# EAGLE design HWProgUSB (EAGLE 6.4)
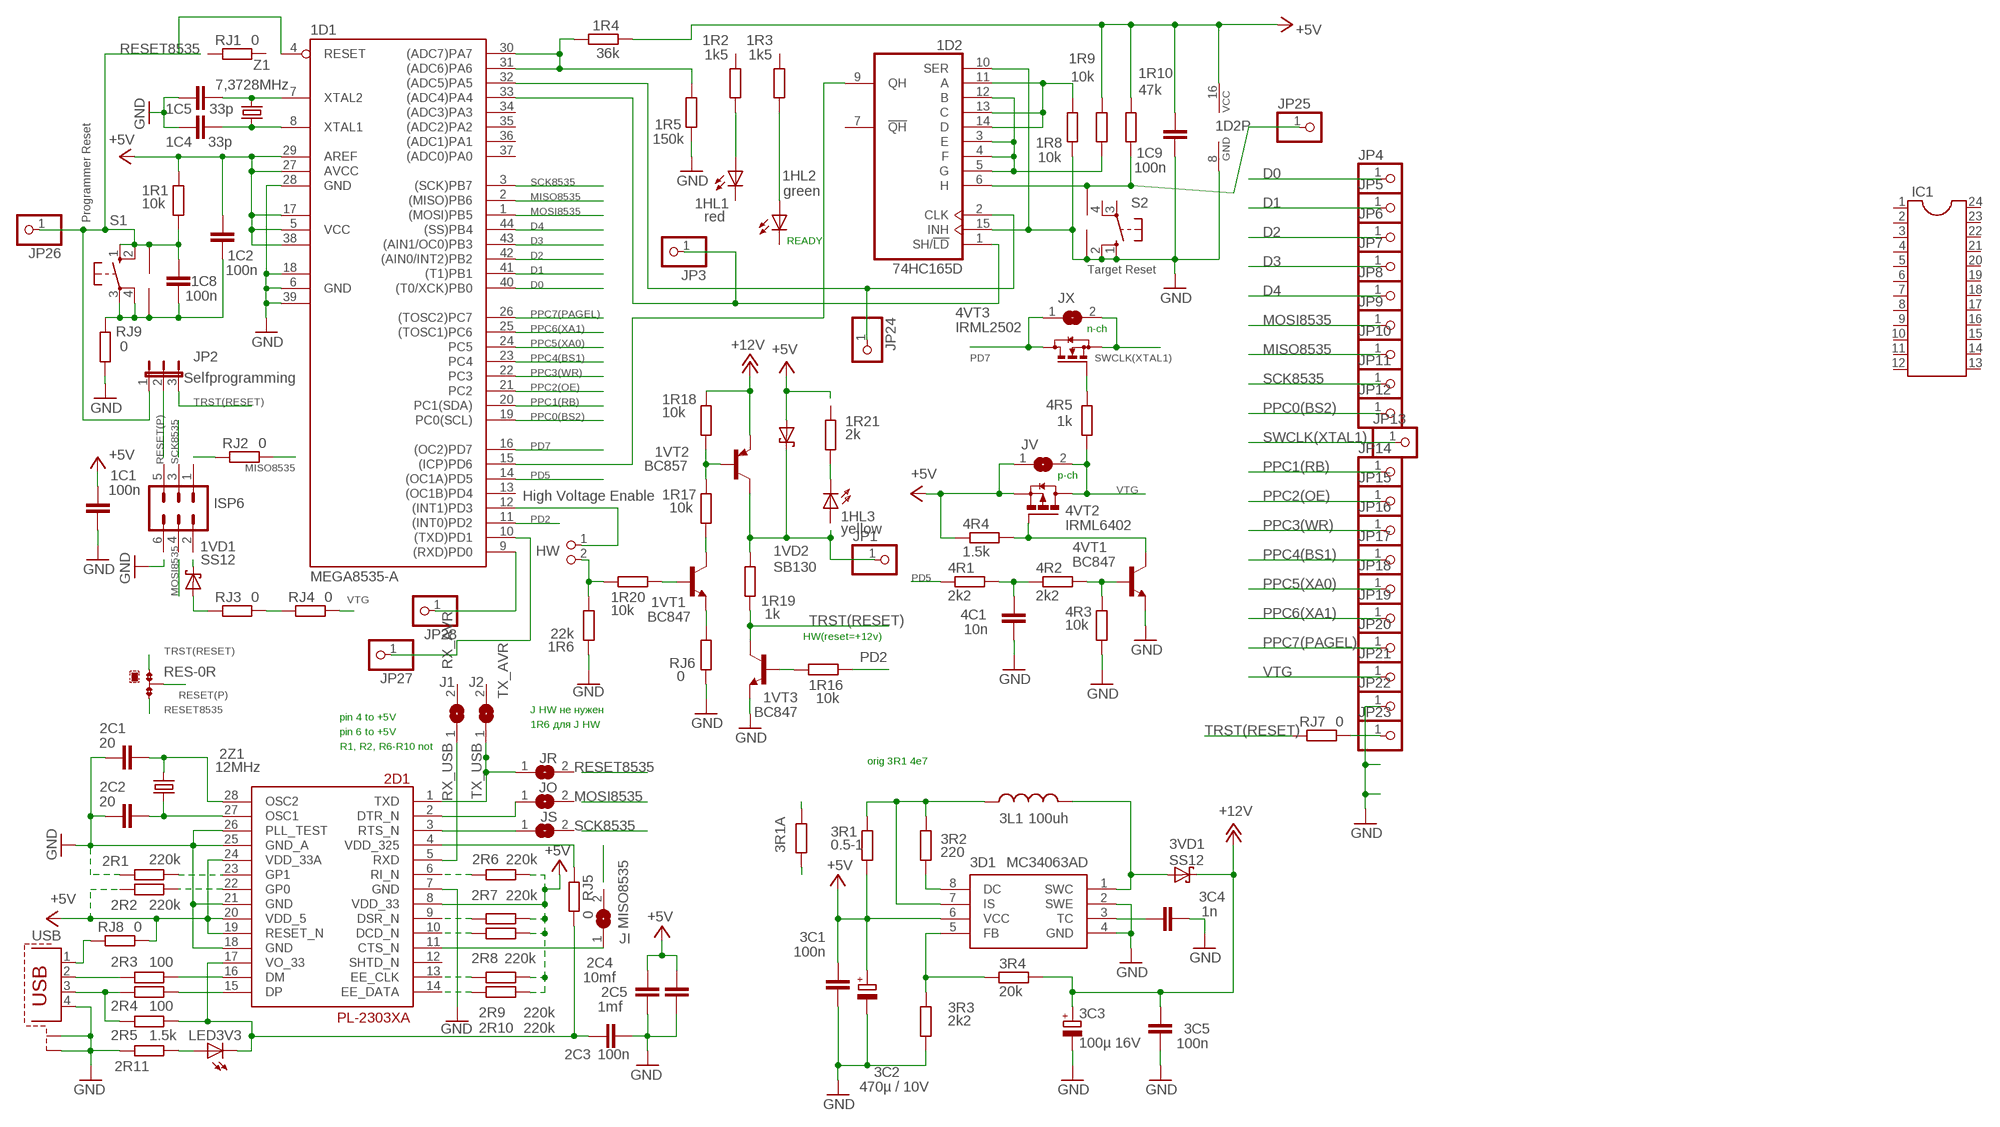
[diagram p0: schematic, sheet 1]

## Parts
1C1  100n  C-EUC0805  [C0805]
1C2  100n  C-EUC0805  [C0805]
1C4  33p  C-EUC0805  [C0805]
1C5  33p  C-EUC0805  [C0805]
1C8  100n  C-EUC0805  [C0805]
1C9  100n  C-EUC0805  [C0805]
1D1  MEGA8535-A  [TQFP44]
1D2  74HC165D  [SO16]
1HL1  red  LED5MM  [LED5MM]
1HL2  green  LED5MM  [LED5MM]
1HL3  yellow  LED5MM  [LED5MM]
1R1  10k  R-EU_M0805  [M0805]
1R2  1k5  R-EU_M0805  [M0805]
1R3  1k5  R-EU_M0805  [M0805]
1R4  36k  R-EU_M0805  [M0805]
1R5  150k  R-EU_R1206  [R1206]
1R6  22k  R-EU_M1206  [M1206]
1R8  10k  R-EU_M0805  [M0805]
1R9  10k  R-EU_M0805  [M0805]
1R10  47k  R-EU_M0805  [M0805]
1R16  10k  R-EU_R0805  [R0805]
1R17  10k  R-EU_M0805  [M0805]
1R18  10k  R-EU_M0805  [M0805]
1R19  1k  R-EU_M0805  [M0805]
1R20  10k  R-EU_M0805  [M0805]
1R21  2k  R-EU_R1206W  [R1206W]
1VD1  SS12  SCHOTTKY-DIODESMD  [SMB]
1VD2  SB130  SCHOTTKY-DIODESMD  [SMB]
1VT1  BC847  [SOT23]
1VT2  BC857  BC857A-PNP-SOT23-BEC  [SOT23-BEC]
1VT3  BC847  [SOT23]
2C1  20  C-EUC0805  [C0805]
2C2  20  C-EUC0805  [C0805]
2C3  100n  C-EUC0805  [C0805]
2C4  10mf  C-EUC1210  [C1210]
2C5  1mf  C-EUC0805  [C0805]
2D1  PL-2303XA  [SSOP28DB]
2R1  220k  R-EU_R0603  [R0603]
2R2  220k  R-EU_R1206W  [R1206W]
2R3  100  R-EU_R0603  [R0603]
2R4  100  R-EU_R0603  [R0603]
2R5  1.5k  R-EU_R0603  [R0603]
2R6  220k  R-EU_R1206W  [R1206W]
2R7  220k  R-EU_R0603  [R0603]
2R8  220k  R-EU_R0603  [R0603]
2R9  220k  R-EU_R0603  [R0603]
2R10  220k  R-EU_R0603  [R0603]
2R11  R-EU_R0603  [R0603]
2Z1  12MHz  CRYSTALHC49S  [HC49/S]
3C1  100n  C-EU025-024X044  [C025-024X044]
3C2  470µ / 10V  RCL_CPOL-EUE3.5-8  [RCL_E3,5-8]
3C3  100µ 16V  RCL_CPOL-EUE3.5-8  [RCL_E3,5-8]
3C4  1n  C-EU025-025X050  [C025-025X050]
3C5  100n  C-EU025-025X050  [C025-025X050]
3D1  MC34063AD  [SOIC8]
3L1  100uh  L-US0207/10  [0207/10]
3R1  0.5-1  R-EU_0204/7  [0204/7]
3R1A  R-EU_0204/7  [0204/7]
3R2  220  R-EU_0204/7  [0204/7]
3R3  2k2  R-EU_M0805  [M0805]
3R4  20k  R-EU_M0805  [M0805]
3VD1  SS12  SCHOTTKY-DIODESMD  [SMB]
4C1  10n  C-EUC1206  [C1206]
4R1  2k2  R-EU_M0805  [M0805]
4R2  2k2  R-EU_M1206  [M1206]
4R3  10k  R-EU_M0805  [M0805]
4R4  1.5k  R-EU_M0805  [M0805]
4R5  1k  R-EU_M0805  [M0805]
4VT1  BC847  [SOT23]
4VT2  IRML6402  FDN360P  [SUPER-SOT3]
4VT3  IRML2502  BSS123  [SOT23]
HW  High Voltage Enable  PINHEAD_PINHD-1X2  [PINHEAD_1X02]
IC1  DIL24-9  [DIL24-9]
ISP6  MA03-2  [MA03-2]
J1  SJ  [SJ]
J2  SJ  [SJ]
JI  SJ  [SJ]
JO  SJ  [SJ]
JP1  PINHD-1X1  [1X01]
JP2  Selfprogramming  JUMPER_JP2E  [JUMPER_JP2]
JP3  PINHD-1X1  [1X01]
JP4  PINHD-1X1  [1X01]
JP5  PINHD-1X1  [1X01]
JP6  PINHD-1X1  [1X01]
JP7  PINHD-1X1  [1X01]
JP8  PINHD-1X1  [1X01]
JP9  PINHD-1X1  [1X01]
JP10  PINHD-1X1  [1X01]
JP11  PINHD-1X1  [1X01]
JP12  PINHD-1X1  [1X01]
JP13  PINHD-1X1  [1X01]
JP14  PINHD-1X1  [1X01]
JP15  PINHD-1X1  [1X01]
JP16  PINHD-1X1  [1X01]
JP17  PINHD-1X1  [1X01]
JP18  PINHD-1X1  [1X01]
JP19  PINHD-1X1  [1X01]
JP20  PINHD-1X1  [1X01]
JP21  PINHD-1X1  [1X01]
JP22  PINHD-1X1  [1X01]
JP23  PINHD-1X1  [1X01]
JP24  PINHD-1X1  [1X01]
JP25  PINHD-1X1  [1X01]
JP26  PINHD-1X1  [1X01]
JP27  PINHD-1X1  [1X01]
JP28  PINHD-1X1  [1X01]
JR  SJ  [SJ]
JS  SJ  [SJ]
JV  SJ  [SJ]
JX  SJ  [SJ]
LED3V3  LEDCHIPLED_0603  [CHIPLED_0603]
RES  0R-JUMPA  [A0R-JMP]
RJ1  0  R-EU_R1206  [R1206]
RJ2  0  R-EU_R1206  [R1206]
RJ3  0  R-EU_R1206  [R1206]
RJ4  0  R-EU_R1206  [R1206]
RJ5  0  R-EU_R1206  [R1206]
RJ6  0  R-EU_R1206  [R1206]
RJ7  0  R-EU_R1206  [R1206]
RJ8  0  R-EU_R1206  [R1206]
RJ9  0  R-EU_R1206  [R1206]
S1  10-XX  [B3F-10XX]
S2  10-XX  [B3F-10XX]
U$1  5.08  [KEY]
U$2  5.08  [KEY]
USB  PROGRAMMER_PN61729-S  [PROGRAMMER_PN61729-S]
Z1  7,3728MHz  CRYTALHC49U-V  [HC49U-V]

## Nets
3VUSB: 2C3.1 2D1.17(VO_33) 2R5.1 LED3V3.C RJ5.2
+5V: 1C1.2 1C2.2 1C9.1 1D1.5(VCC) 1D1.17(VCC1) 1D1.27(AVCC) 1D1.29(AREF) 1D1.38(VCC2) 1D2.16(VCC) 1R1.2 1R4.2 1R9.1 1R10.1 1VD2.A 2C4.2 2C5.2 2D1.8(VDD_33) 2D1.19(RESET_N) 2D1.20(VDD_5) 2D1.24(VDD_33A) 2R2.1 2R6.2 2R7.1 2R8.1 2R9.1 2R10.1 3C1.1 3C2.+ 3D1.6(VCC) 3R1.1 3R1A.1 4R4.1 4VT2.2(S) JV.1 RJ8.2
+12V: 1R18.2 1VT2.E 3C3.+ 3C5.2 3R4.2 3VD1.C
D0: 1D1.40((T0/XCK)PB0) JP4.1
D1: 1D1.41((T1)PB1) JP5.1
D2: 1D1.42((AIN0/INT2)PB2) JP6.1
D3: 1D1.43((AIN1/OC0)PB3) JP7.1
D4: 1D1.44((SS)PB4) JP8.1
GND: 1C1.1 1C4.1 1C5.1 1C9.2 1D1.6(GND) 1D1.18(GND1) 1D1.28(GND) 1D1.39(GND2) 1D2.8(GND) 1D2.10(SER) 1D2.15(INH) 1R5.1 1R6.1 1R8.1 1VT3.2(E) 2C1.1 2C2.1 2C3.2 2C4.1 2C5.1 2D1.7(GND) 2D1.18(GND) 2D1.21(GND) 2D1.25(GND_A) 2D1.26(PLL_TEST) 2R1.1 2R11.2 3C1.2 3C2.- 3C3.- 3C4.2 3C5.1 3D1.2(SWE) 3D1.4(GND) 3R3.1 4C1.1 4R3.1 4VT1.2(E) JP22.1 RJ6.1 RJ9.1 S2.1(S) S2.2(S1) U$2.P$1 USB.4 USB.S1 USB.S2
MISO8535: 1D1.2((MISO)PB6) JP10.1 RJ2.2
MOSI8535: 1D1.1((MOSI)PB5) JP9.1
N4: 1D1.33((ADC4)PA4) 1D2.1(SH/!LD) JP3.1
N$1: JP23.1 RJ7.2
N$3: RJ2.1
N$4: 2D1.4(VDD_325) RJ5.1
N$5: 1VT1.2(E) RJ6.2
N$6: 1VD1.C
N$7: 2D1.9(DSR_N) 2R7.2
N$9: 1VD1.A RJ3.1
N$10: RJ3.2 RJ4.1
N$12: 1C5.2 1D1.7(XTAL2) Z1.2
N$13: 1C4.2 1D1.8(XTAL1) Z1.1
N$14: RJ8.1 USB.1
N$15: 1C2.1 1C8.1 RJ9.2 S1.3(P) S1.4(P1) U$1.P$1
N$20: 1HL3.K(C) 1R21.1
N$21: 4R5.2 4VT3.1(G)
N$22: 2R11.1 LED3V3.A
N$45: 2R4.1 2R5.2 USB.3
N$46: 2R3.1 USB.2
N$47: 2D1.15(DP) 2R4.2
N$48: 2D1.16(DM) 2R3.2
N$49: 2D1.23(GP1) 2R1.2
N$52: 2D1.22(GP0) 2R2.2
N$53: 2C1.2 2D1.28(OSC2) 2Z1.2
N$54: 2D1.11(CTS_N) JI.1
N$55: 4R2.2 4R3.2 4VT1.1(B)
N$56: 2C2.2 2D1.27(OSC1) 2Z1.1
N$58: 2D1.6(RI_N) 2R6.1
N$59: 4R4.2 4VT1.3(C) 4VT2.1(G)
N$60: 2D1.3(RTS_N) JS.1
N$62: 4C1.2 4R1.2 4R2.1
N$68: 2D1.13(EE_CLK) 2R9.2
N$69: 2D1.2(DTR_N) JO.1
N$70: 2D1.14(EE_DATA) 2R10.2
N$80: 2D1.10(DCD_N) 2R8.2
N$104: 3D1.8(DC) 3R2.1
N$105: 3D1.7(IS) 3L1.1 3R1.2 3R1A.2 3R2.2
N$106: 3D1.5(FB) 3R3.2 3R4.1
N$107: 3D1.1(SWC) 3L1.2 3VD1.A
N$108: 3C4.1 3D1.3(TC)
N$122: 1HL2.A 1R3.1
N$123: 1D1.30((ADC7)PA7) 1D1.31((ADC6)PA6) 1R4.1 1R5.2
N$124: 1D1.32((ADC5)PA5) 1D2.2(CLK) JP24.1
N$125: 1D2.6(H) 1R10.2 JP25.1 U$2.P$2
N$131: 1D1.12((INT1)PD3) HW.1
N$132: 1R6.2 1R20.2 HW.2
N$133: 1R19.2 1VD2.C 1VT2.C JP1.1
N$134: 1R20.1 1VT1.1(B)
N$135: 1R17.1 1VT1.3(C)
N$136: 1R17.2 1R18.1 1VT2.B
N$137: 1D1.15((ICP)PD6) 1D2.9(QH)
N$138: 1HL1.A 1R2.1
N$139: 1D2.11(A) 1D2.13(C) 1D2.14(D) 1R8.2
N$140: 1D2.3(E) 1D2.4(F) 1D2.5(G) 1D2.12(B) 1R9.2
N$141: 1R16.2 1VT3.1(B)
PD2: 1D1.11((INT0)PD2) 1R16.1
PD5: 1D1.14((OC1A)PD5) 4R1.1
PD7: 1D1.16((OC2)PD7) 4VT3.3(D) JX.1
PPC0(BS2): 1D1.19(PC0(SCL)) JP12.1
PPC1(RB): 1D1.20(PC1(SDA)) JP14.1
PPC2(OE): 1D1.21(PC2) JP15.1
PPC3(WR): 1D1.22(PC3) JP16.1
PPC4(BS1): 1D1.23(PC4) JP17.1
PPC5(XA0): 1D1.24(PC5) JP18.1
PPC6(XA1): 1D1.25((TOSC1)PC6) JP19.1
PPC7(PAGEL): 1D1.26((TOSC2)PC7) JP20.1
RESET8535: 1C8.2 1D1.4(RESET) 1R1.1 JP2.1 JP26.1 RES.3 S1.1(S) S1.2(S1) U$1.P$2
RESET(P): JP2.2 RES.2
RX_AVR: 1D1.10((TXD)PD1) JP27.1
RX_USB: 2D1.5(RXD) J1.1
SCK8535: 1D1.3((SCK)PB7) JP11.1
SWCLK(XTAL1): 4VT3.2(S) JP13.1 JX.2
TRST(RESET): 1R19.1 1VT3.3(C) JP2.3 RES.1 RJ7.1
TX_AVR: 1D1.9((RXD)PD0) JP28.1
TX_USB: 2D1.1(TXD) J2.1 JR.1
VTG: 4R5.1 4VT2.3(D) JP21.1 JV.2 RJ4.2
Unconnected: 1D1.13((OC1B)PD4) 1D1.34((ADC3)PA3) 1D1.35((ADC2)PA2) 1D1.36((ADC1)PA1) 1D1.37((ADC0)PA0) 1D2.7(!QH) 1HL1.K(C) 1HL2.K(C) 1HL3.A 1R2.2 1R3.2 1R21.2 2D1.12(SHTD_N) IC1.1 IC1.2 IC1.3 IC1.4 IC1.5 IC1.6 IC1.7 IC1.8 IC1.9 IC1.10 IC1.11 IC1.12 IC1.13 IC1.14 IC1.15 IC1.16 IC1.17 IC1.18 IC1.19 IC1.20 IC1.21 IC1.22 IC1.23 IC1.24 ISP6.1 ISP6.2 ISP6.3 ISP6.4 ISP6.5 ISP6.6 J1.2 J2.2 JI.2 JO.2 JR.2 JS.2 RJ1.1 RJ1.2 S2.3(P) S2.4(P1)

## Notes on the sheet
- Programmer Reset
- READY
- Target Reset
- n-ch
- p-ch
- HW(reset=+12v)
- J HW не нужен
- pin 4 to +5V
- 1R6 для J HW
- pin 6 to +5V
- R1, R2, R6-R10 not
- orig 3R1 4e7

## Library data of the parts
1C1 1C2 1C4 1C5 1C8 1C9 2C4 2C5 3C4 3C5 4C1 = rcl:C-EU: CAPACITOR, European symbol
1D1 = atmel:MEGA8535: MICROCONTROLLER 8 Kbytes FLASH 512 bytes SRAM 512 bytes EEPROM USART 8-channel 10 bit ADC Source: avr.lbr; MPN: ATMEGA8535-16AU; OC_FARNELL: 1528437; OC_NEWARK: 01M6908
1D2 = 74xx-eu:74*165: 8-bit parallel load SHIFT REGISTER
1HL1 1HL2 LED3V3 = led:LED: LED OSRAM: - CHIPLED LG R971, LG N971, LY N971, LG Q971, LY Q971, LO R971, LY R971 LH N974, LH R974 LS Q976, LO Q976, LY Q976 LO Q996 - Hyper CHIPLED LW Q18S LB Q993, LB Q99A, LB R99A - SideLED LS A670, LO A670, LY A670, LG A670, LP A670 LB A673, LV A673, LT A673, LW A673 LH A674 LY A675 LS A676, LA A676, LO A676, LY A676, LW A676 LS A679, LY A679, LG A679 - Hyper Micro SIDELED® LS Y876, LA Y876, LO Y876, LY Y876 LT Y87S - SmartLED LW L88C, LW L88S LB L89C, LB L89S, LG L890 LS L89K, LO L89K, LY L89K LS L896, LA L896, LO L896, LY L896 - TOPLED LS T670, LO T670, LY T670, LG T670, LP T670 LSG T670, LSP T670, LSY T670, LOP T670, LYG T670 LG T671, LOG T671, LSG T671 LB T673, LV T673, LT T673, LW T673 LH T674 LS T676, LA T676, LO T676, LY T676, LB T676, LH T676, LSB T676, LW T676 LB T67C, LV T67C, LT T67C, LS T67K, LO T67K, LY T67K, LW E67C LS E67B, LA E67B, LO E67B, LY E67B, LB E67C, LV E67C, LT E67C LW T67C LS T679, LY T679, LG T679 LS T770, LO T770, LY T770, LG T770, LP T770 LB T773, LV T773, LT T773, LW T773 LH T774 LS E675, LA E675, LY E675, LS T675 LS T776, LA T776, LO T776, LY T776, LB T776 LHGB T686 LT T68C, LB T68C - Hyper Mini TOPLED® LB M676 - Mini TOPLED Santana® LG M470 LS M47K, LO M47K, LY M47K Source: http://www.osram.convergy.de LUXEON: - LUMILED® LXK2-PW12-R00, LXK2-PW12-S00, LXK2-PW14-U00, LXK2-PW14-V00 LXK2-PM12-R00, LXK2-PM12-S00, LXK2-PM14-U00 LXK2-PE12-Q00, LXK2-PE12-R00, LXK2-PE12-S00, LXK2-PE14-T00, LXK2-PE14-U00 LXK2-PB12-K00, LXK2-PB12-L00, LXK2-PB12-M00, LXK2-PB14-N00, LXK2-PB14-P00, LXK2-PB14-Q00 LXK2-PR12-L00, LXK2-PR12-M00, LXK2-PR14-Q00, LXK2-PR14-R00 LXK2-PD12-Q00, LXK2-PD12-R00, LXK2-PD12-S00 LXK2-PH12-R00, LXK2-PH12-S00 LXK2-PL12-P00, LXK2-PL12-Q00, LXK2-PL12-R00 Source: www.luxeon.com KINGBRIGHT: KA-3528ASYC Source: www.kingbright.com
1HL3 = rc-elektronik:LED: LED OSRAM: - CHIPLED LG R971, LG N971, LY N971, LG Q971, LY Q971, LO R971, LY R971 LH N974, LH R974 LS Q976, LO Q976, LY Q976 LO Q996 - Hyper CHIPLED LW Q18S LB Q993, LB Q99A, LB R99A - SideLED LS A670, LO A670, LY A670, LG A670, LP A670 LB A673, LV A673, LT A673, LW A673 LH A674 LY A675 LS A676, LA A676, LO A676, LY A676, LW A676 LS A679, LY A679, LG A679 - Hyper Micro SIDELED® LS Y876, LA Y876, LO Y876, LY Y876 LT Y87S - SmartLED LW L88C, LW L88S LB L89C, LB L89S, LG L890 LS L89K, LO L89K, LY L89K LS L896, LA L896, LO L896, LY L896 - TOPLED LS T670, LO T670, LY T670, LG T670, LP T670 LSG T670, LSP T670, LSY T670, LOP T670, LYG T670 LG T671, LOG T671, LSG T671 LB T673, LV T673, LT T673, LW T673 LH T674 LS T676, LA T676, LO T676, LY T676, LB T676, LH T676, LSB T676, LW T676 LB T67C, LV T67C, LT T67C, LS T67K, LO T67K, LY T67K, LW E67C LS E67B, LA E67B, LO E67B, LY E67B, LB E67C, LV E67C, LT E67C LW T67C LS T679, LY T679, LG T679 LS T770, LO T770, LY T770, LG T770, LP T770 LB T773, LV T773, LT T773, LW T773 LH T774 LS E675, LA E675, LY E675, LS T675 LS T776, LA T776, LO T776, LY T776, LB T776 LHGB T686 LT T68C, LB T68C - Hyper Mini TOPLED® LB M676 - Mini TOPLED Santana® LG M470 LS M47K, LO M47K, LY M47K Source: http://www.osram.convergy.de LUXEON: - LUMILED® LXK2-PW12-R00, LXK2-PW12-S00, LXK2-PW14-U00, LXK2-PW14-V00 LXK2-PM12-R00, LXK2-PM12-S00, LXK2-PM14-U00 LXK2-PE12-Q00, LXK2-PE12-R00, LXK2-PE12-S00, LXK2-PE14-T00, LXK2-PE14-U00 LXK2-PB12-K00, LXK2-PB12-L00, LXK2-PB12-M00, LXK2-PB14-N00, LXK2-PB14-P00, LXK2-PB14-Q00 LXK2-PR12-L00, LXK2-PR12-M00, LXK2-PR14-Q00, LXK2-PR14-R00 LXK2-PD12-Q00, LXK2-PD12-R00, LXK2-PD12-S00 LXK2-PH12-R00, LXK2-PH12-S00 LXK2-PL12-P00, LXK2-PL12-Q00, LXK2-PL12-R00 Source: www.luxeon.com KINGBRIGHT: KA-3528ASYC Source: www.kingbright.com
1R1-1R6 1R8-1R10 1R16-1R21 3R1 3R1A 3R2-3R4 4R1-4R5 RJ1-RJ9 = rcl:R-EU_: RESISTOR, European symbol
1VD1 1VD2 3VD1 = diode:SCHOTTKY-DIODE: Schottky Diode
1VT1 1VT3 = transistor:BC847: NPN TRANSISTOR
1VT2 = transistor:*-PNP-: PNP Transistror
2C1-2C3 = resistor:C-EU: CAPACITOR, European symbol
2D1 = SparkFun-DigitalIC:PL-2303XA: Prolific USB chip, requires 12MHz xtal
2R1-2R11 = resistor:R-EU_: RESISTOR, European symbol
2Z1 = crystal:CRYSTAL: CRYSTAL; OC_FARNELL: 1667008; OC_NEWARK: unknown
3C1 = rc-elektronik:C-EU: CAPACITOR, European symbol
3C2 3C3 = HWProgUSB:RCL_CPOL-EU: POLARIZED CAPACITOR, European symbol
3D1 = mc34063:MC34063
3L1 = rcl:L-US: INDUCTOR, American symbol
4VT1 = transistor-neu-to92:BC847: NPN TRANSISTOR
4VT2 = transistor-power:FDN360P: Single P-Channel, PowerTrench (R) MOSFET Source: http://www.fairchildsemi.com/ds/FD/FDN360P.pdf
4VT3 = transistor-small-signal:BSS123: N-CHANNEL MOS FET
HW = HWProgUSB:PINHEAD_PINHD-1X2: PIN HEADER
IC1 = ic-package:DIL24: Dual In Line
ISP6 = con-lstb:MA03-2: PIN HEADER
J1 J2 JI JO JR JS JV JX = jumper:SJ: SMD solder JUMPER
JP1 JP3-JP28 = Разъёмы штырьковые 2.54мм:PINHD-1X1: PIN HEADER
JP2 = HWProgUSB:JUMPER_JP2E: JUMPER
RES = jump-0r-smd:0R-JUMP: SMD 0R 0805 Jumper
S1 S2 = switch-omron:10-XX: OMRON SWITCH
U$1 U$2 = Programmer:5.08
USB = HWProgUSB:PROGRAMMER_PN61729-S: BERG USB connector
Z1 = crystal:CRYTAL: CRYSTAL

## Board
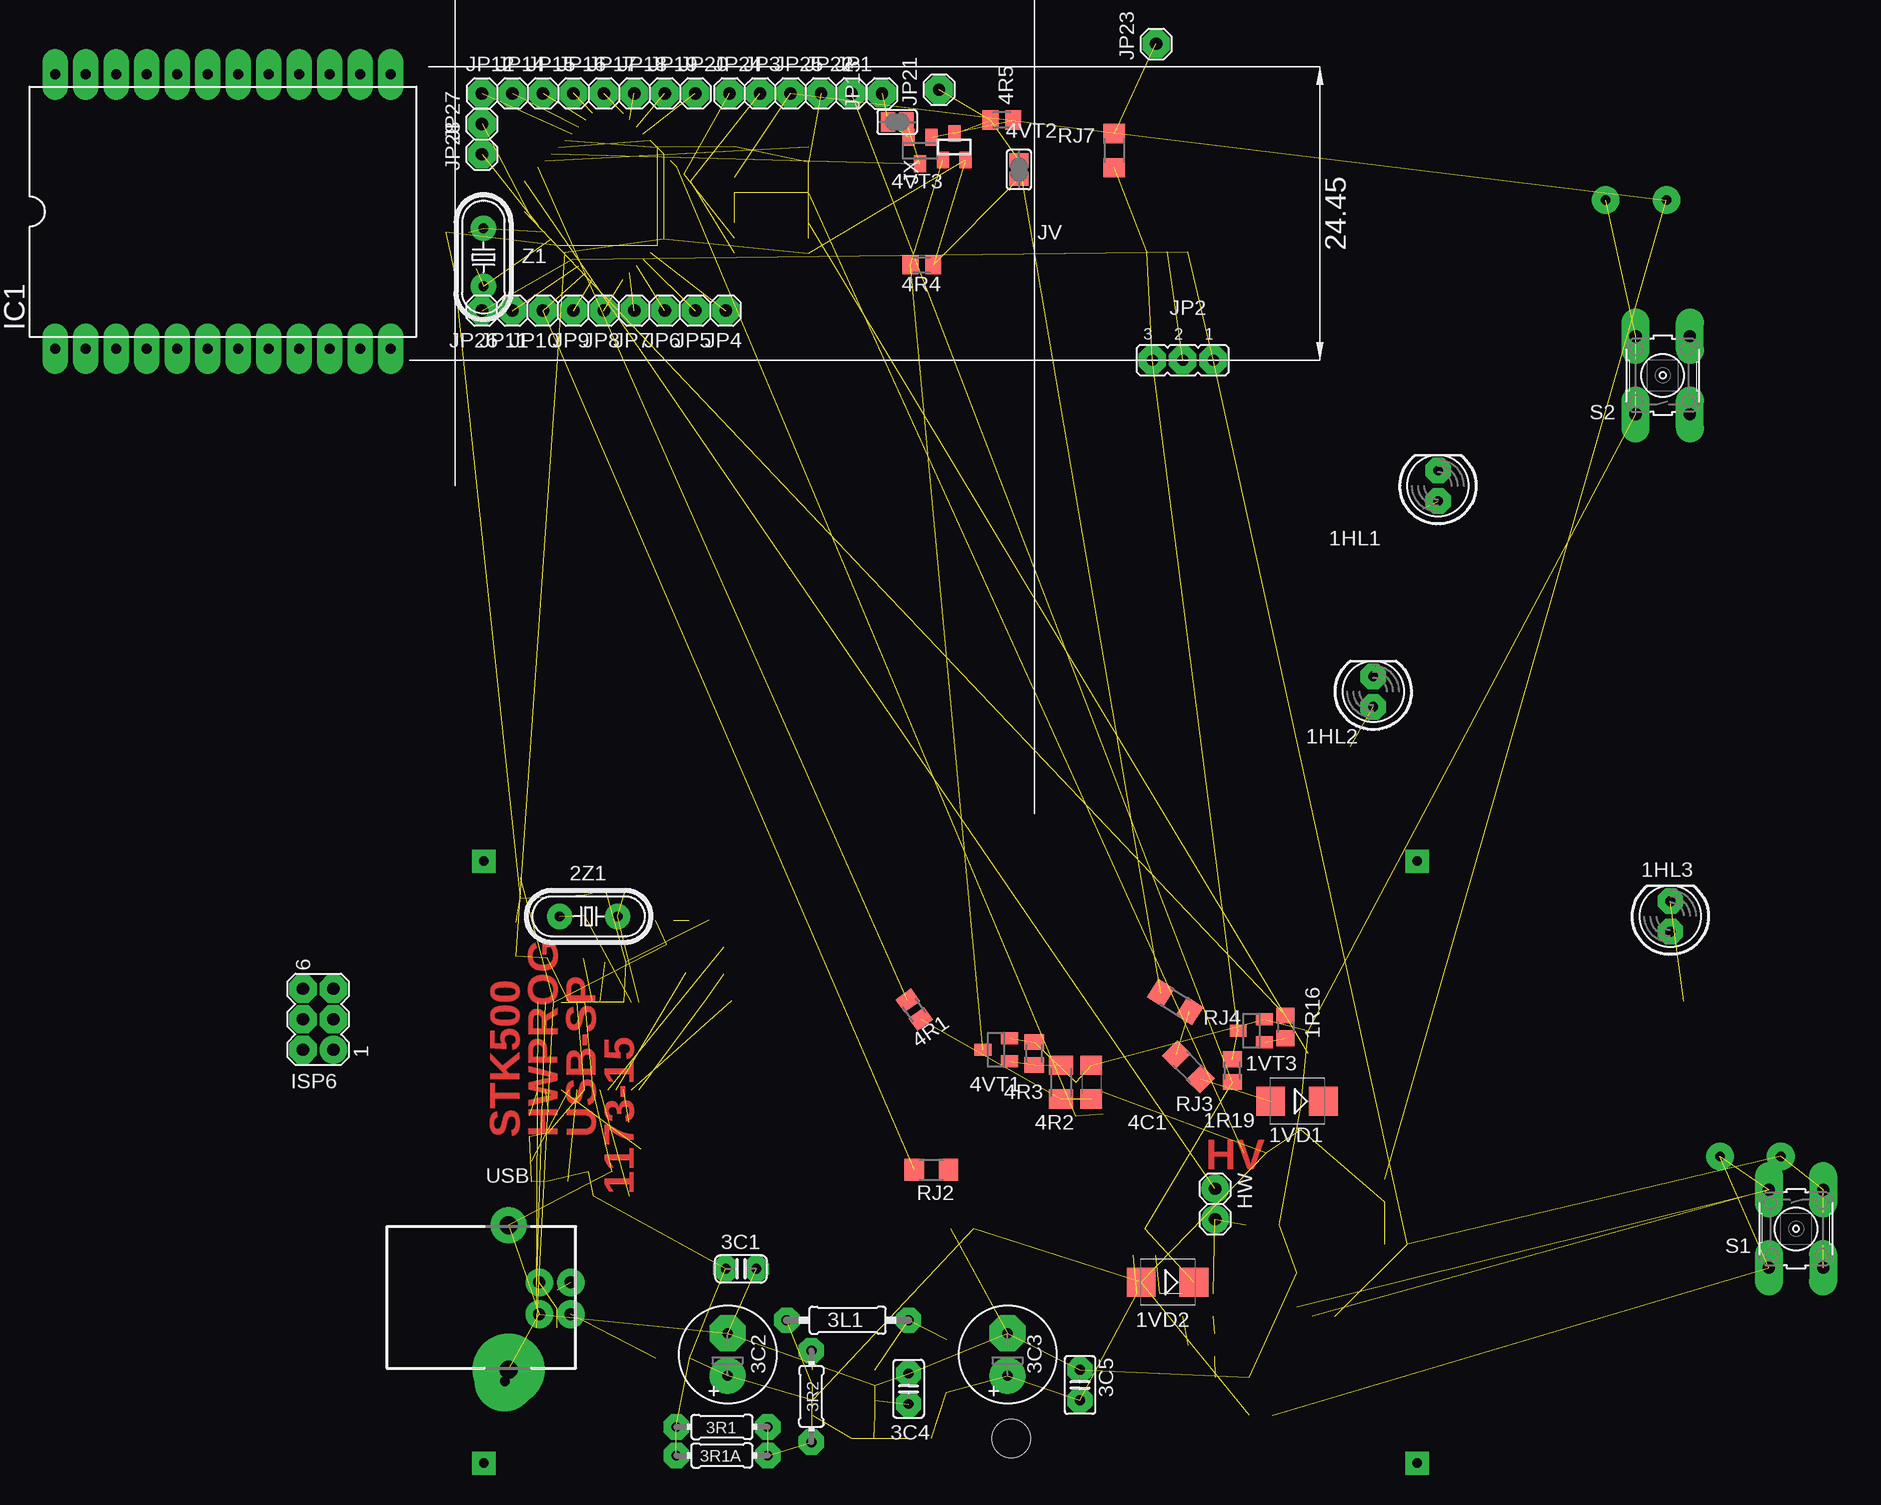
[diagram p1: board, top side]
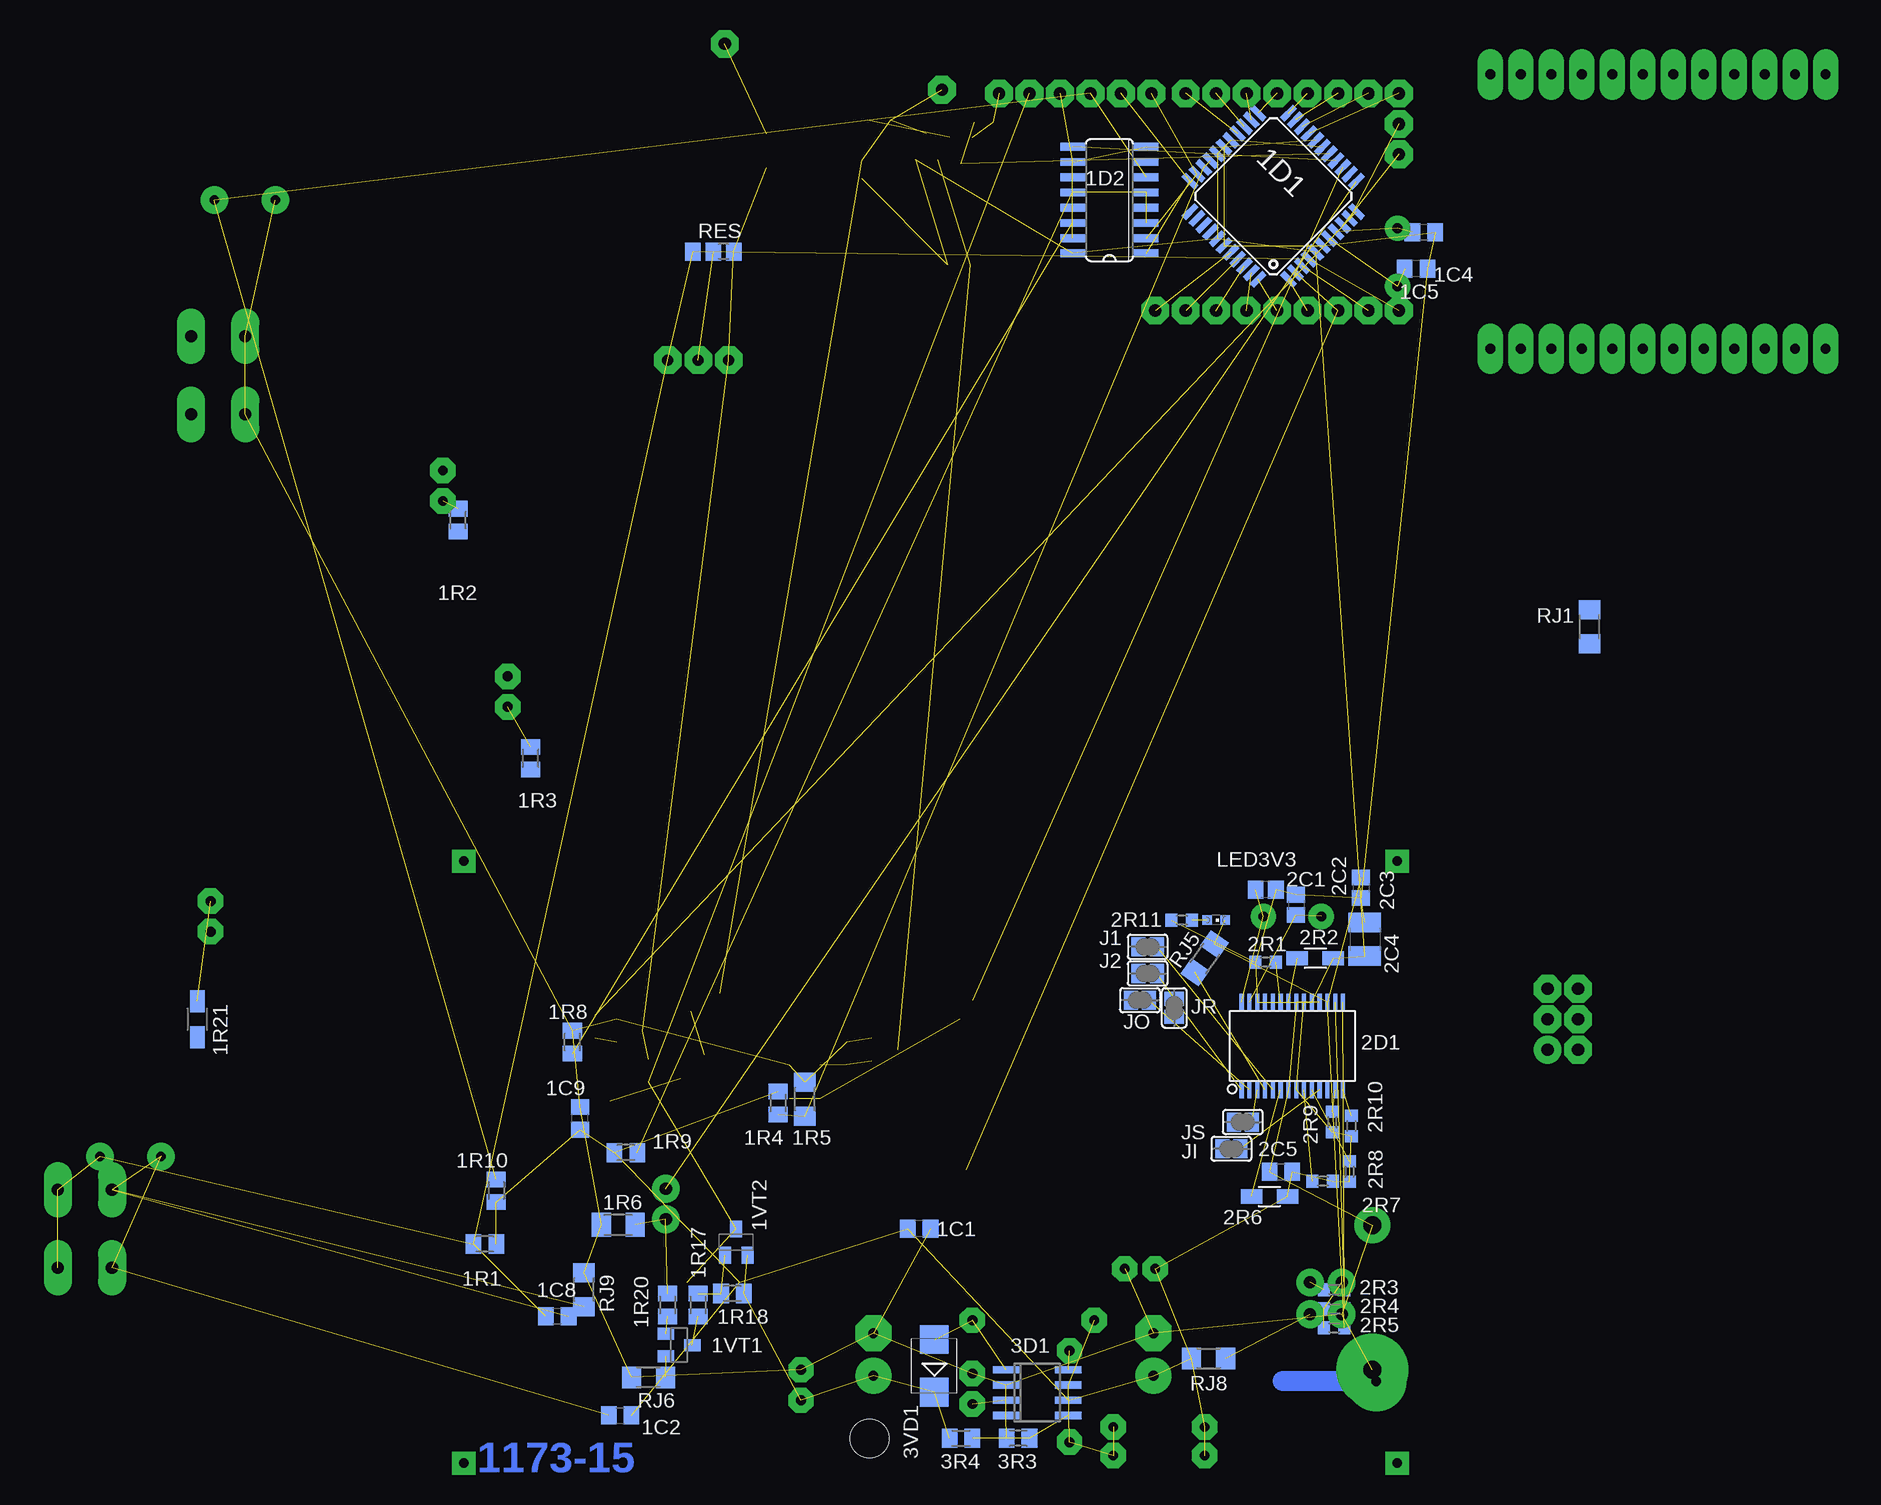
[diagram p2: board, bottom side, seen from below]

No outline drawn. Coordinates in mm, seen from the top.
Copper layers (1*16): Top 0.035mm / dielectric 1.5mm / Bottom 0.035mm
Design rules "DesignRules": minimum track width 8mil, minimum drill 24mil, track to track 0.2mm, track to pad 0.2mm, pad to pad 8mil, via to via 8mil, smd to smd 8mil, copper to edge 10mil, drill to drill 8mil, minimum pad ring 0.65mm, minimum via ring 8mil, stop-mask expansion 4mil, vias tented up to drill 0mil, thermal gap 10mil
Holes 3.2 mm at 45.09,3.17

### Footprints (pad centres in the part's own frame; a part is rotated, then mirrored left to right if it is on the bottom)
C0805 = smd 1.3 x 1.5: 1 -0.95,0; 2 0.95,0
TQFP44 = smd 1.5 x 0.5: 1 -5.8,4; 2 -5.8,3.2; 3 -5.8,2.4; 4 -5.8,1.6; 5 -5.8,0.8; 6 -5.8,0; 7 -5.8,-0.8; 8 -5.8,-1.6; 9 -5.8,-2.4; 10 -5.8,-3.2; 11 -5.8,-4; 23 5.8,-4; 24 5.8,-3.2; 25 5.8,-2.4; 26 5.8,-1.6; 27 5.8,-0.8; 28 5.8,0; 29 5.8,0.8; 30 5.8,1.6; 31 5.8,2.4; 32 5.8,3.2; 33 5.8,4 | smd 0.5 x 1.5: 12 -4,-5.8; 13 -3.2,-5.8; 14 -2.4,-5.8; 15 -1.6,-5.8; 16 -0.8,-5.8; 17 0,-5.8; 18 0.8,-5.8; 19 1.6,-5.8; 20 2.4,-5.8; 21 3.2,-5.8; 22 4,-5.8; 34 4,5.8; 35 3.2,5.8; 36 2.4,5.8; 37 1.6,5.8; 38 0.8,5.8; 39 0,5.8; 40 -0.8,5.8; 41 -1.6,5.8; 42 -2.4,5.8; 43 -3.2,5.8; 44 -4,5.8
SO16 = smd 0.66 x 2.032: 1 -4.445,-3.073; 2 -3.175,-3.073; 3 -1.905,-3.073; 4 -0.635,-3.073; 5 0.635,-3.073; 6 1.905,-3.073; 7 3.175,-3.073; 8 4.445,-3.073; 9 4.445,3.073; 10 3.175,3.073; 11 1.905,3.073; 12 0.635,3.073; 13 -0.635,3.073; 14 -1.905,3.073; 15 -3.175,3.073; 16 -4.445,3.073
LED5MM = drill 0.813 octagon: A -1.27,0; K 1.27,0
M0805 = smd 1.3 x 1.6: 1 -0.95,0; 2 0.95,0
R1206 = smd 1.6 x 1.803: 1 -1.422,0; 2 1.422,0
M1206 = smd 1.6 x 2: 1 -1.4,0; 2 1.4,0
R0805 = smd 1.3 x 1.5: 1 -0.95,0; 2 0.95,0
R1206W = smd 1.8 x 1.2: 1 -1.499,0; 2 1.499,0
SMB = smd 2.4 x 2.4: A 2.2,0; C -2.2,0
SOT23 = smd 1 x 1.4: 1 -0.95,-1.1; 2 0.95,-1.1; 3 0,1.1
SOT23-BEC = smd 1 x 1.4: B -0.95,-1.1; C 0,1.1; E 0.95,-1.1
C0805' = smd 1.3 x 1.5: 1 -0.85,0; 2 0.85,0
C1210 = smd 1.6 x 2.7: 1 -1.4,0; 2 1.4,0
SSOP28DB = smd 0.348 x 1.397: 1 -4.225,-3.656; 2 -3.575,-3.656; 3 -2.925,-3.656; 4 -2.275,-3.656; 5 -1.625,-3.656; 6 -0.975,-3.656; 7 -0.325,-3.656; 8 0.325,-3.656; 9 0.975,-3.656; 10 1.625,-3.656; 11 2.275,-3.656; 12 2.925,-3.656; 13 3.575,-3.656; 14 4.225,-3.656; 15 4.225,3.656; 16 3.575,3.656; 17 2.925,3.656; 18 2.275,3.656; 19 1.625,3.656; 20 0.975,3.656; 21 0.325,3.656; 22 -0.325,3.656; 23 -0.975,3.656; 24 -1.625,3.656; 25 -2.275,3.656; 26 -2.925,3.656; 27 -3.575,3.656; 28 -4.225,3.656
R0603 = smd 1 x 1.1: 1 -0.85,0; 2 0.85,0
HC49/S = drill 0.813: 1 -2.413,0; 2 2.413,0
C025-024X044 = drill 0.813 octagon: 1 -1.27,0; 2 1.27,0
RCL_E3,5-8 = drill 0.813 pad 3: + -1.778,0 | drill 0.813 pad 3 octagon: - 1.778,0
C025-025X050 = drill 0.813 octagon: 1 -1.27,0; 2 1.27,0
SOIC8 = smd 0.6 x 2.2: 1 -1.905,-2.6; 2 -0.635,-2.6; 3 0.635,-2.6; 4 1.905,-2.6; 5 1.905,2.6; 6 0.635,2.6; 7 -0.635,2.6; 8 -1.905,2.6
0207/10 = drill 0.813 octagon: 1 -5.08,0; 2 5.08,0
0204/7 = drill 0.813 octagon: 1 -3.81,0; 2 3.81,0
C1206 = smd 1.6 x 1.8: 1 -1.4,0; 2 1.4,0
SUPER-SOT3 = smd 1 x 1.4: 1 -0.95,-1.1; 2 0.95,-1.1; 3 0,1.1
PINHEAD_1X02 = drill 1.016 pad 2.3: 1 -1.27,0; 2 1.27,0
DIL24-9 = drill 0.813 long: 1 -13.97,-11.43; 2 -11.43,-11.43; 3 -8.89,-11.43; 4 -6.35,-11.43; 5 -3.81,-11.43; 6 -1.27,-11.43; 7 1.27,-11.43; 8 3.81,-11.43; 9 6.35,-11.43; 10 8.89,-11.43; 11 11.43,-11.43; 12 13.97,-11.43; 13 13.97,11.43; 14 11.43,11.43; 15 8.89,11.43; 16 6.35,11.43; 17 3.81,11.43; 18 1.27,11.43; 19 -1.27,11.43; 20 -3.81,11.43; 21 -6.35,11.43; 22 -8.89,11.43; 23 -11.43,11.43; 24 -13.97,11.43
MA03-2 = drill 1.016: 1 -2.54,-1.27 | drill 1.016 octagon: 2 -2.54,1.27; 3 0,-1.27; 4 0,1.27; 5 2.54,-1.27; 6 2.54,1.27
SJ = smd 1.168 x 1.6: 1 -0.762,0; 2 0.762,0
1X01 = drill 1.016 octagon: 1 0,0
JUMPER_JP2 = drill 0.914 pad 2.3 octagon: 1 -2.54,0; 2 0,0; 3 2.54,0
CHIPLED_0603 = smd 0.8 x 0.8: A 0,-0.75; C 0,0.75
A0R-JMP = smd 1.5 x 1.3: 1 0,1.7; 2 0,0; 3 0,-1.7
B3F-10XX = drill 1.016 long: 1 -3.251,2.261; 2 3.251,2.261; 3 -3.251,-2.261; 4 3.251,-2.261
KEY = drill 0.8 pad 2.3: P$1 -2.54,0.635; P$2 2.54,0.635
PROGRAMMER_PN61729-S = drill 1 pad 2: 1 1.409,5.186; 2 -1.25,5.186; 3 -1.25,2.551; 4 1.409,2.551 | drill 1.5 pad 3: S1 -6.02,0 | drill 1.5 pad 6: S2 6.02,0
HC49U-V = drill 0.813: 1 -2.413,0; 2 2.413,0

### Placement (x,y rotation side)
1C1  40.96,20.64 180 bottom
1C2  65.88,5.08 0 bottom
1C4  -1.11,103.66 180 bottom
1C5  -0.48,100.65 180 bottom
1C8  71.12,13.34 180 bottom
1C9  69.22,29.84 90 bottom
1D1  11.43,106.68 135 bottom
1D2  25.08,106.36 90 bottom
1HL1  80.64,82.55 90 top
1HL2  75.25,65.41 90 top
1HL3  100.01,46.67 90 top
1R1  77.15,19.37 0 bottom
1R2  79.38,79.69 270 bottom
1R3  73.34,59.85 270 bottom
1R4  52.7,31.11 90 bottom
1R5  50.48,31.43 270 bottom
1R6  66.04,20.95 0 bottom
1R8  69.85,36.2 270 bottom
1R9  65.41,26.99 0 bottom
1R10  76.2,23.81 90 bottom
1R16  67.94,37.47 270 top
1R17  59.37,14.29 90 bottom
1R18  56.52,15.24 0 bottom
1R19  63.5,33.81 270 top
1R20  61.91,14.29 90 bottom
1R21  101.12,38.1 270 bottom
1VD1  68.9,31.27 180 top
1VD2  58.1,16.19 180 top
1VT1  60.96,10.95 270 bottom
1VT2  56.2,19.53 0 bottom
1VT3  65.09,37.15 90 top
2C1  20  [C0805']  12.06,48.9 180 bottom
2C2  20  [C0805']  9.53,47.62 270 bottom
2C3  100n  [C0805']  4.13,49.05 270 bottom
2C4  3.81,44.77 270 bottom
2C5  10.79,25.4 0 bottom
2D1  9.84,35.88 0 bottom
2R1  12.06,42.86 0 bottom
2R2  7.94,43.18 180 bottom
2R3  6.35,15.56 0 bottom
2R4  6.35,13.97 0 bottom
2R5  6.35,12.38 180 bottom
2R6  11.75,23.34 0 bottom
2R7  7.3,24.61 180 bottom
2R8  5.08,25.4 90 bottom
2R9  6.51,29.53 90 bottom
2R10  4.92,29.21 90 bottom
2R11  19.05,46.35 180 bottom
2Z1  9.84,46.67 0 top
3C1  22.54,17.3 0 top
3C2  21.43,10.16 90 top
3C3  44.77,10.16 90 top
3C4  36.51,7.3 90 top
3C5  50.8,7.62 270 top
3D1  31.11,6.99 270 bottom
3L1  31.43,13.02 0 top
3R1  20.95,4.13 0 top
3R1A  20.95,1.75 0 top
3R2  28.42,6.67 270 top
3R3  32.7,3.17 0 bottom
3R4  37.47,3.17 180 bottom
3VD1  39.69,9.21 90 bottom
4C1  51.75,32.86 270 top
4R1  36.99,38.89 305 top
4R2  49.21,32.86 90 top
4R3  46.99,35.24 270 top
4R4  37.62,100.97 180 top
4R5  44.29,113.03 0 top
4VT1  43.81,35.56 90 top
4VT2  40.32,110.81 0 top
4VT3  37.47,110.49 180 top
HW  62.07,22.7 270 top
IC1  -20.64,105.41 0 top
ISP6  -12.7,38.1 90 top
J1  21.91,44.13 180 bottom
J2  21.91,41.91 180 bottom
JI  14.92,27.3 180 bottom
JO  22.54,39.69 180 bottom
JP1  31.75,115.25 0 top
JP2  59.37,93.03 180 top
JP3  24.13,115.25 0 top
JP4  21.27,97.16 180 top
JP5  18.73,97.16 180 top
JP6  16.19,97.16 180 top
JP7  13.65,97.16 180 top
JP8  11.11,97.16 180 top
JP9  8.57,97.16 180 top
JP10  6.03,97.16 180 top
JP11  3.49,97.16 180 top
JP12  0.95,115.25 0 top
JP13  34.29,115.25 90 top
JP14  3.49,115.25 0 top
JP15  6.03,115.25 0 top
JP16  8.57,115.25 0 top
JP17  11.11,115.25 0 top
JP18  13.65,115.25 0 top
JP19  16.19,115.25 0 top
JP20  18.73,115.25 0 top
JP21  39.05,115.57 90 top
JP22  29.21,115.25 0 top
JP23  57.15,119.38 90 top
JP24  21.59,115.25 0 top
JP25  26.67,115.25 0 top
JP26  0.95,97.16 180 top
JP27  0.95,112.71 90 top
JP28  0.95,110.17 90 top
JR  19.68,39.05 270 bottom
JS  13.97,29.53 180 bottom
JV  45.72,108.9 90 top
JX  35.56,112.87 180 top
LED3V3  16.19,46.35 270 bottom
RES  58.1,102.08 270 bottom
RJ1  -14.92,70.8 270 bottom
RJ2  38.42,25.56 180 top
RJ3  59.85,34.13 135 top
RJ4  58.74,39.53 148 top
RJ5  17.14,43.18 55 bottom
RJ6  63.5,8.26 0 bottom
RJ7  53.66,110.49 90 top
RJ8  16.83,9.84 180 bottom
RJ9  68.9,15.56 270 bottom
S1  110.49,20.64 270 top
S2  99.38,91.76 90 top
U$1  106.68,26.04 0 top
U$2  97.16,105.73 0 top
USB  3.17,14.92 270 top
Z1  1.08,101.6 270 top

### Tracks (layer width: path | path; a pad name or v marks a point on that pad's centre or on a via)
3VUSB  (4 unrouted)
+5V  (34 unrouted)
+12V  (5 unrouted)
D0  (1 unrouted)
D1  (1 unrouted)
D2  (1 unrouted)
D3  (1 unrouted)
D4  (1 unrouted)
GND  (46 unrouted)
MISO8535  (2 unrouted)
MOSI8535  (1 unrouted)
N4  (2 unrouted)
N$1  (1 unrouted)
N$4  (1 unrouted)
N$5  (1 unrouted)
N$7  (1 unrouted)
N$9  (1 unrouted)
N$10  (1 unrouted)
N$11  (via drill 0.8 pad 5)
  Bottom 1.676: v2.86,7.94 10.64,7.94
N$12  (2 unrouted)
N$13  (2 unrouted)
N$14  (1 unrouted)
N$15  (5 unrouted)
N$16  (via drill 0.8 pad 1.93)
  other vias: 78.9,1.11
N$17  (via drill 0.8 pad 1.93)
  other vias: 1.11,1.11
N$18  (via drill 0.8 pad 1.93)
  other vias: 1.11,51.28
N$19  (via drill 0.8 pad 1.93)
  other vias: 78.9,51.28
N$20  (1 unrouted)
N$21  (1 unrouted)
N$22  (1 unrouted)
N$45  (2 unrouted)
N$46  (1 unrouted)
N$47  (1 unrouted)
N$48  (1 unrouted)
N$49  (1 unrouted)
N$52  (1 unrouted)
N$53  (2 unrouted)
N$54  (1 unrouted)
N$55  (2 unrouted)
N$56  (2 unrouted)
N$58  (1 unrouted)
N$59  (2 unrouted)
N$60  (1 unrouted)
N$62  (2 unrouted)
N$68  (1 unrouted)
N$69  (1 unrouted)
N$70  (1 unrouted)
N$80  (1 unrouted)
N$104  (1 unrouted)
N$105  (4 unrouted)
N$106  (2 unrouted)
N$107  (2 unrouted)
N$108  (1 unrouted)
N$122  (1 unrouted)
N$123  (3 unrouted)
N$124  (2 unrouted)
N$125  (3 unrouted)
N$131  (1 unrouted)
N$132  (2 unrouted)
N$133  (3 unrouted)
N$134  (1 unrouted)
N$135  (1 unrouted)
N$136  (2 unrouted)
N$137  (1 unrouted)
N$138  (1 unrouted)
N$139  (3 unrouted)
N$140  (4 unrouted)
N$141  (1 unrouted)
PD2  (1 unrouted)
PD5  (1 unrouted)
PD7  (2 unrouted)
PPC0(BS2)  (1 unrouted)
PPC1(RB)  (1 unrouted)
PPC2(OE)  (1 unrouted)
PPC3(WR)  (1 unrouted)
PPC4(BS1)  (1 unrouted)
PPC5(XA0)  (1 unrouted)
PPC6(XA1)  (1 unrouted)
PPC7(PAGEL)  (1 unrouted)
RESET8535  (8 unrouted)
RESET(P)  (1 unrouted)
RX_AVR  (1 unrouted)
RX_USB  (1 unrouted)
SCK8535  (1 unrouted)
SWCLK(XTAL1)  (2 unrouted)
TRST(RESET)  (4 unrouted)
TX_AVR  (1 unrouted)
TX_USB  (2 unrouted)
VTG  (4 unrouted)

### Text on the board
Top: STK500 | HWPROG | USB-SP | HV | 1173-15
Bottom: 1173-15
bJumper: 1 | 1
tJumper: T | P